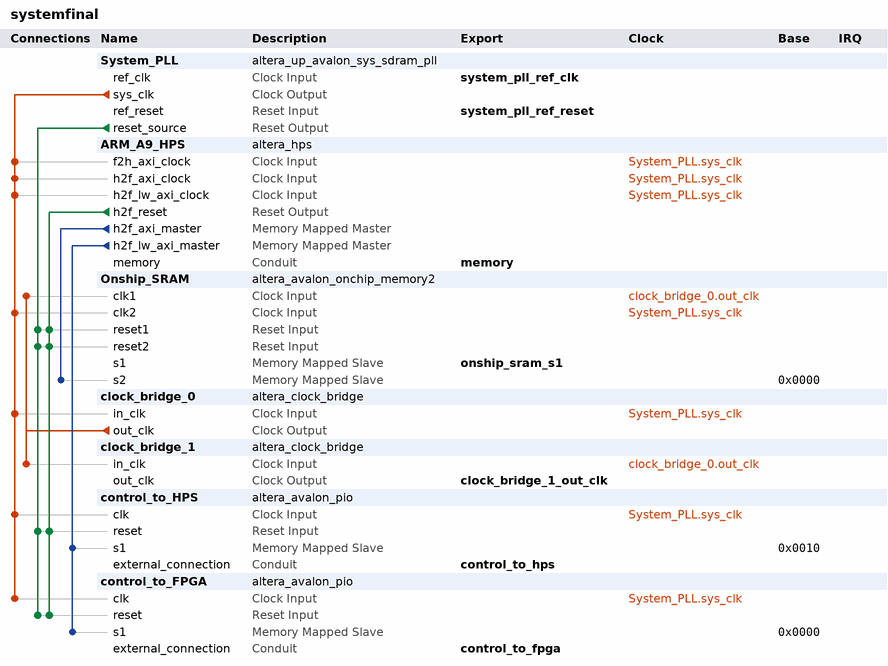
[diagram p0: system contents]
# Platform Designer (Qsys) system systemfinal, Cyclone V 5CSEMA5F31C6
# Parameters at their usual value, and those the tool derives, are not listed.
package require -exact qsys 20.1
create_system systemfinal
set_project_property DEVICE_FAMILY {Cyclone V}
set_project_property DEVICE 5CSEMA5F31C6

add_instance System_PLL altera_up_avalon_sys_sdram_pll 18.0
set_instance_parameter_value System_PLL CV_boards DE1-SoC
set_instance_parameter_value System_PLL gui_outclk 100.0
set_instance_parameter_value System_PLL gui_refclk 50.0

add_instance ARM_A9_HPS altera_hps 20.1
set_instance_parameter_value ARM_A9_HPS EMAC1_Mode N/A
set_instance_parameter_value ARM_A9_HPS EMAC1_PinMuxing Unused
set_instance_parameter_value ARM_A9_HPS F2SCLK_COLDRST_Enable false
set_instance_parameter_value ARM_A9_HPS F2SCLK_DBGRST_Enable false
set_instance_parameter_value ARM_A9_HPS F2SCLK_WARMRST_Enable false
set_instance_parameter_value ARM_A9_HPS F2SINTERRUPT_Enable true
set_instance_parameter_value ARM_A9_HPS F2S_Width 3
set_instance_parameter_value ARM_A9_HPS FPGA_PERIPHERAL_OUTPUT_CLOCK_FREQ_EMAC0_GTX_CLK 100
set_instance_parameter_value ARM_A9_HPS FPGA_PERIPHERAL_OUTPUT_CLOCK_FREQ_EMAC0_MD_CLK 2.5
set_instance_parameter_value ARM_A9_HPS FPGA_PERIPHERAL_OUTPUT_CLOCK_FREQ_EMAC1_GTX_CLK 100
set_instance_parameter_value ARM_A9_HPS FPGA_PERIPHERAL_OUTPUT_CLOCK_FREQ_EMAC1_MD_CLK 2.5
set_instance_parameter_value ARM_A9_HPS HPS_PROTOCOL DDR3
set_instance_parameter_value ARM_A9_HPS I2C0_Mode N/A
set_instance_parameter_value ARM_A9_HPS I2C0_PinMuxing Unused
set_instance_parameter_value ARM_A9_HPS I2C1_Mode N/A
set_instance_parameter_value ARM_A9_HPS I2C1_PinMuxing Unused
set_instance_parameter_value ARM_A9_HPS LWH2F_Enable true
set_instance_parameter_value ARM_A9_HPS MEM_BANKADDR_WIDTH 3
set_instance_parameter_value ARM_A9_HPS MEM_CLK_FREQ 300.0
set_instance_parameter_value ARM_A9_HPS MEM_CLK_FREQ_MAX 400.0
set_instance_parameter_value ARM_A9_HPS MEM_COL_ADDR_WIDTH 8
set_instance_parameter_value ARM_A9_HPS MEM_DQ_WIDTH 8
set_instance_parameter_value ARM_A9_HPS MEM_DRV_STR RZQ/6
set_instance_parameter_value ARM_A9_HPS MEM_ROW_ADDR_WIDTH 12
set_instance_parameter_value ARM_A9_HPS MEM_RTT_NOM RZQ/6
set_instance_parameter_value ARM_A9_HPS MEM_RTT_WR {Dynamic ODT off}
set_instance_parameter_value ARM_A9_HPS MEM_TCL 7
set_instance_parameter_value ARM_A9_HPS MEM_TFAW_NS 37.5
set_instance_parameter_value ARM_A9_HPS MEM_TINIT_US 499
set_instance_parameter_value ARM_A9_HPS MEM_TMRD_CK 3
set_instance_parameter_value ARM_A9_HPS MEM_TRAS_NS 40.0
set_instance_parameter_value ARM_A9_HPS MEM_TRCD_NS 15.0
set_instance_parameter_value ARM_A9_HPS MEM_TREFI_US 7.0
set_instance_parameter_value ARM_A9_HPS MEM_TRFC_NS 75.0
set_instance_parameter_value ARM_A9_HPS MEM_TRP_NS 15.0
set_instance_parameter_value ARM_A9_HPS MEM_TWTR 2
set_instance_parameter_value ARM_A9_HPS MEM_VENDOR JEDEC
set_instance_parameter_value ARM_A9_HPS MEM_WTCL 6
set_instance_parameter_value ARM_A9_HPS QSPI_Mode N/A
set_instance_parameter_value ARM_A9_HPS QSPI_PinMuxing Unused
set_instance_parameter_value ARM_A9_HPS REF_CLK_FREQ 125.0
set_instance_parameter_value ARM_A9_HPS S2FCLK_USER2CLK 5
set_instance_parameter_value ARM_A9_HPS S2F_Width 3
set_instance_parameter_value ARM_A9_HPS SDIO_Mode N/A
set_instance_parameter_value ARM_A9_HPS SDIO_PinMuxing Unused
set_instance_parameter_value ARM_A9_HPS SPIM1_Mode N/A
set_instance_parameter_value ARM_A9_HPS SPIM1_PinMuxing Unused
set_instance_parameter_value ARM_A9_HPS STM_Enable false
set_instance_parameter_value ARM_A9_HPS TIMING_BOARD_AC_SKEW 0.02
set_instance_parameter_value ARM_A9_HPS TIMING_BOARD_AC_TO_CK_SKEW 0.0
set_instance_parameter_value ARM_A9_HPS TIMING_BOARD_DQ_TO_DQS_SKEW 0.0
set_instance_parameter_value ARM_A9_HPS TIMING_BOARD_MAX_CK_DELAY 0.6
set_instance_parameter_value ARM_A9_HPS TIMING_BOARD_MAX_DQS_DELAY 0.6
set_instance_parameter_value ARM_A9_HPS TIMING_BOARD_SKEW_BETWEEN_DQS 0.02
set_instance_parameter_value ARM_A9_HPS TIMING_BOARD_SKEW_CKDQS_DIMM_MAX 0.01
set_instance_parameter_value ARM_A9_HPS TIMING_BOARD_SKEW_CKDQS_DIMM_MIN -0.01
set_instance_parameter_value ARM_A9_HPS TIMING_BOARD_SKEW_WITHIN_DQS 0.02
set_instance_parameter_value ARM_A9_HPS TIMING_TDH 125
set_instance_parameter_value ARM_A9_HPS TIMING_TDQSCK 400
set_instance_parameter_value ARM_A9_HPS TIMING_TDQSQ 120
set_instance_parameter_value ARM_A9_HPS TIMING_TDS 50
set_instance_parameter_value ARM_A9_HPS TIMING_TIH 250
set_instance_parameter_value ARM_A9_HPS TIMING_TIS 175
set_instance_parameter_value ARM_A9_HPS TIMING_TQSH 0.38
set_instance_parameter_value ARM_A9_HPS UART0_Mode N/A
set_instance_parameter_value ARM_A9_HPS UART0_PinMuxing Unused
set_instance_parameter_value ARM_A9_HPS USB1_Mode N/A
set_instance_parameter_value ARM_A9_HPS USB1_PinMuxing Unused
set_instance_parameter_value ARM_A9_HPS desired_cfg_clk_mhz 100.0
set_instance_parameter_value ARM_A9_HPS desired_qspi_clk_mhz 400.0

add_instance Onship_SRAM altera_avalon_onchip_memory2 20.1
set_instance_parameter_value Onship_SRAM dataWidth 32
set_instance_parameter_value Onship_SRAM dualPort true
set_instance_parameter_value Onship_SRAM initMemContent false
set_instance_parameter_value Onship_SRAM initializationFileName onchip_mem.hex
set_instance_parameter_value Onship_SRAM memorySize 16384

add_instance clock_bridge_0 altera_clock_bridge 20.1
set_instance_parameter_value clock_bridge_0 DERIVED_CLOCK_RATE 100000000
set_instance_parameter_value clock_bridge_0 EXPLICIT_CLOCK_RATE 0

add_instance clock_bridge_1 altera_clock_bridge 20.1
set_instance_parameter_value clock_bridge_1 DERIVED_CLOCK_RATE 100000000
set_instance_parameter_value clock_bridge_1 EXPLICIT_CLOCK_RATE 0

add_instance control_to_HPS altera_avalon_pio 20.1
set_instance_parameter_value control_to_HPS direction Input
set_instance_parameter_value control_to_HPS width 1

add_instance control_to_FPGA altera_avalon_pio 20.1
set_instance_parameter_value control_to_FPGA direction Output
set_instance_parameter_value control_to_FPGA width 32

# connections
add_connection clock_bridge_0.out_clk clock_bridge_1.in_clk clock
add_connection clock_bridge_0.out_clk Onship_SRAM.clk1 clock
add_connection System_PLL.sys_clk ARM_A9_HPS.f2h_axi_clock clock
add_connection System_PLL.sys_clk ARM_A9_HPS.h2f_axi_clock clock
add_connection System_PLL.sys_clk ARM_A9_HPS.h2f_lw_axi_clock clock
add_connection System_PLL.sys_clk clock_bridge_0.in_clk clock
add_connection System_PLL.sys_clk control_to_FPGA.clk clock
add_connection System_PLL.sys_clk control_to_HPS.clk clock
add_connection System_PLL.sys_clk Onship_SRAM.clk2 clock
add_connection ARM_A9_HPS.h2f_reset control_to_FPGA.reset reset
add_connection ARM_A9_HPS.h2f_reset control_to_HPS.reset reset
add_connection ARM_A9_HPS.h2f_reset Onship_SRAM.reset1 reset
add_connection ARM_A9_HPS.h2f_reset Onship_SRAM.reset2 reset
add_connection System_PLL.reset_source control_to_FPGA.reset reset
add_connection System_PLL.reset_source control_to_HPS.reset reset
add_connection System_PLL.reset_source Onship_SRAM.reset1 reset
add_connection System_PLL.reset_source Onship_SRAM.reset2 reset
add_connection ARM_A9_HPS.h2f_axi_master Onship_SRAM.s2 avalon
set_connection_parameter_value ARM_A9_HPS.h2f_axi_master/Onship_SRAM.s2 baseAddress 0x0000
add_connection ARM_A9_HPS.h2f_lw_axi_master control_to_FPGA.s1 avalon
set_connection_parameter_value ARM_A9_HPS.h2f_lw_axi_master/control_to_FPGA.s1 baseAddress 0x0000
add_connection ARM_A9_HPS.h2f_lw_axi_master control_to_HPS.s1 avalon
set_connection_parameter_value ARM_A9_HPS.h2f_lw_axi_master/control_to_HPS.s1 baseAddress 0x0010

# exported interfaces
add_interface clock_bridge_1_out_clk clock source
set_interface_property clock_bridge_1_out_clk EXPORT_OF clock_bridge_1.out_clk
add_interface control_to_fpga conduit end
set_interface_property control_to_fpga EXPORT_OF control_to_FPGA.external_connection
add_interface control_to_hps conduit end
set_interface_property control_to_hps EXPORT_OF control_to_HPS.external_connection
add_interface memory conduit end
set_interface_property memory EXPORT_OF ARM_A9_HPS.memory
add_interface onship_sram_s1 avalon slave
set_interface_property onship_sram_s1 EXPORT_OF Onship_SRAM.s1
add_interface system_pll_ref_clk clock sink
set_interface_property system_pll_ref_clk EXPORT_OF System_PLL.ref_clk
add_interface system_pll_ref_reset reset sink
set_interface_property system_pll_ref_reset EXPORT_OF System_PLL.ref_reset

set_interconnect_requirement {$system} qsys_mm.clockCrossingAdapter HANDSHAKE
set_interconnect_requirement {$system} qsys_mm.enableEccProtection FALSE
set_interconnect_requirement {$system} qsys_mm.insertDefaultSlave FALSE
set_interconnect_requirement {$system} qsys_mm.maxAdditionalLatency 1

save_system systemfinal.qsys
